# EAGLE design servo_driver (EAGLE 9.3.2)
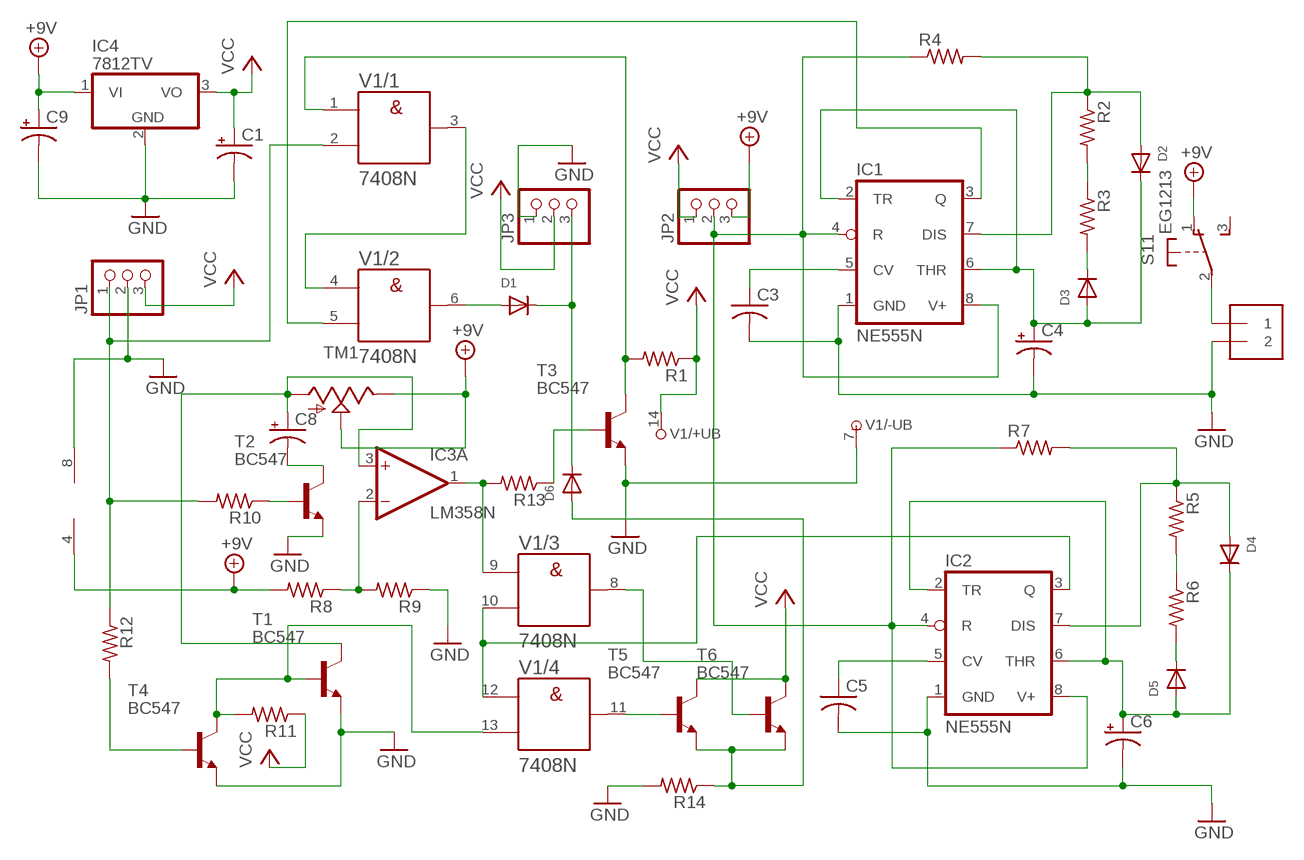
[diagram p0: schematic, sheet 1]

## Parts
C1  CPOL-USE2-4  [E2-4]
C3  C-US025-030X050  [C025-030X050]
C4  CPOL-USE2-4  [E2-4]
C5  C-US025-030X050  [C025-030X050]
C6  CPOL-USE2-4  [E2-4]
C8  CPOL-USE2.5-6  [E2,5-6]
C9  CPOL-USE2.5-6  [E2,5-6]
D1  DIODEDO-1N4148  [DO-1N4148]
D2  DIODEDO-1N4148  [DO-1N4148]
D3  DIODEDO-1N4148  [DO-1N4148]
D4  DIODEDO-1N4148  [DO-1N4148]
D5  DIODEDO-1N4148  [DO-1N4148]
D6  DIODEDO-1N4148  [DO-1N4148]
IC1  NE555N  [DIL08-ROUND]
IC2  NE555N  [DIL08-ROUND]
IC3  LM358N  [DIL08]
IC4  7812TV  [TO220V]
J1  1X2-3.5MM  [1X2-3.5MM]
JP1  PINHD-1X3  [1X03]
JP2  PINHD-1X3  [1X03]
JP3  PINHD-1X3  [1X03]
R1  R-US_0207/9  [0207/9]
R2  R-US_0207/9  [0207/9]
R3  R-US_0207/9  [0207/9]
R4  R-US_0207/9  [0207/9]
R5  R-US_0207/9  [0207/9]
R6  R-US_0207/9  [0207/9]
R7  R-US_0207/9  [0207/9]
R8  R-US_0207/9  [0207/9]
R9  R-US_0207/9  [0207/9]
R10  R-US_0207/9  [0207/9]
R11  R-US_0207/9  [0207/9]
R12  R-US_0207/9  [0207/9]
R13  R-US_0207/9  [0207/9]
R14  R-US_0207/9  [0207/9]
S1  EG1213  [EG1213]
T1  BC547  [TO92]
T2  BC547  [TO92]
T3  BC547  [TO92]
T4  BC547  [TO92]
T5  BC547  [TO92]
T6  BC547  [TO92]
TM1  TRIM  [6MM]
V1  7408N  [DIL14]

## Nets
+9V: C9.+ IC3.4(P:V-) IC4.1(VI) JP2.3 R8.2 S1.1(1:O) TM1.E TM1.S
GND: C1.- C3.2 C4.- C5.2 C6.- C9.- IC1.1(GND) IC2.1(GND) IC3.8(P:V+) IC4.2(GND) J1.2 JP1.2 JP3.1 R9.1 R14.2 T1.1(E) T2.1(E) T3.1(E) T4.1(E) V1.7(/-UB:-UB)
N$1: C4.+ D2.C D3.A IC1.2(TR) IC1.6(THR)
N$2: V1.3(/1:Y) V1.4(/2:A)
N$3: C3.1 IC1.5(CV)
N$4: C6.+ D4.C D5.A IC2.2(TR) IC2.6(THR)
N$5: R2.2 R3.1
N$6: D2.A IC1.7(DIS) R2.1 R4.2
N$7: D3.C R3.2
N$8: C8.- T2.3(C)
N$9: C5.1 IC2.5(CV)
N$10: R5.2 R6.1
N$11: D4.A IC2.7(DIS) R5.1 R7.2
N$12: D5.C R6.2
N$13: D1.A V1.6(/2:Y)
N$14: D1.C D6.C JP3.3
N$15: R1.2 T3.3(C) V1.1(/1:A)
N$16: R13.1 T3.2(B)
N$17: IC3.2(A:-IN) R8.1 R9.2
N$18: D6.A R14.1 T5.1(E) T6.1(E)
N$19: C8.+ IC3.3(A:+IN) T1.3(C) TM1.A
N$20: JP1.1 R10.2 R12.1 V1.2(/1:B)
N$21: R10.1 T2.2(B)
N$22: R11.2 T1.2(B) T4.3(C) V1.13(/4:B)
N$23: R12.2 T4.2(B)
N$24: J1.1 S1.2(1:P)
N$25: IC1.4(R) IC1.8(V+) IC2.4(R) IC2.8(V+) JP2.2 R4.1 R7.1
N$26: IC1.3(Q) V1.5(/2:B)
N$27: IC3.1(A:OUT) R13.2 V1.9(/3:A)
N$28: IC2.3(Q) V1.10(/3:B) V1.12(/4:A)
N$29: T6.2(B) V1.8(/3:Y)
N$30: T5.2(B) V1.11(/4:Y)
VCC: C1.+ IC4.3(VO) JP1.3 JP2.1 JP3.2 R1.1 R11.1 T5.3(C) T6.3(C) V1.14(/+UB:+UB)
Unconnected: IC3.5(B:+IN) IC3.6(B:-IN) IC3.7(B:OUT) S1.3(1:S) S1.MT1(MT) S1.MT2(MT)

## Library data of the parts
C1 C4 C6 C8 C9 = adafruit:CPOL-US: POLARIZED CAPACITOR, American symbol
C3 C5 = adafruit:C-US: CAPACITOR, American symbol
D1-D6 = adafruit:DIODE: Diode SMADIODE - SMA Surface Mount Package 20V 1A Schottky Diode Digikey: 641-1014-6-ND DO-1N4148 - Through Hole Small Current Diode SOD-123 20V 1 A (.5mV Vf) Schottky Diode - Digikey: MBRX120TPMSCT-ND SOD-323 10V 570mA (.38mV Vf, 3ns) Schottky Diode - Digikey: ZLLS410CT-ND SOD-523 30V 30mA Schottky Diode (RB751S-40TE61) - Digikey: RB751S-40TE61CT-ND SOT23-R/W - SOT23 Package (R = Solder Paste/Reflow Ovens, W = Hand-Soldering) BAT54Film 40V 300mA - Digikey: 497-7162-1-ND
IC1 IC2 = adafruit:*555: TIMER Changed DIP package to have round (not oval) pin pads http://www.ladyada.net/library/pcb/eaglelibrary.html
IC3 = linear:LM358: OP AMP also LM158; LM258; LM2904 Source: http://cache.national.com/ds/LM/LM158.pdf
IC4 = linear:78*: Positive VOLTAGE REGULATOR Source: http://cache.national.com/ds/LM/LM78L05.pdf http://www.fairchildsemi.com/ds/LM/LM7805.pdf
J1 = adafruit:1X2: 3.5mm Terminal block http://www.ladyada.net/library/pcb/eaglelibrary.html
JP1-JP3 = adafruit:PINHD-1X3: PIN HEADER
R1-R14 = adafruit:R-US_: RESISTOR, American symbol
S1 = adafruit:EG1213: E-Switch right-angle slide SPDT Part #EG1213 http://www.ladyada.net/library/eagle
T1-T6 = transistor:BC547: NPN TRANSISTOR
TM1 = adafruit:TRIM
V1 = 74ttl-din:74*08: Quad 2-input AND gate

## Board
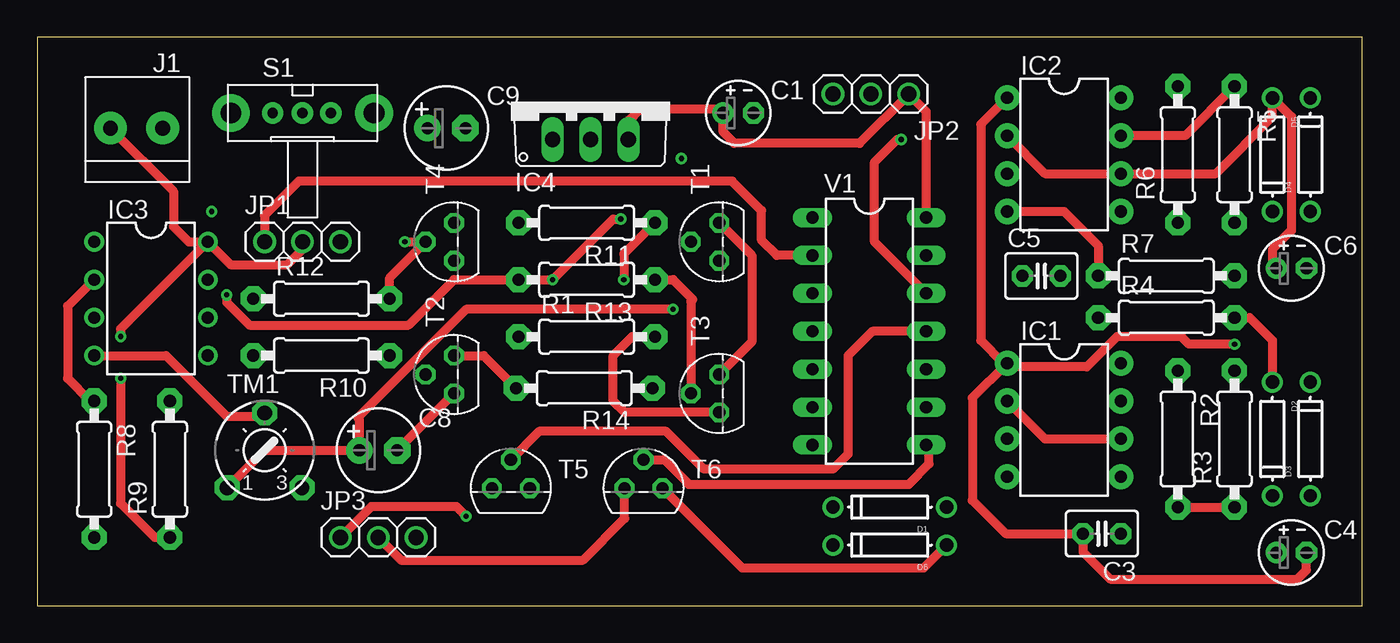
[diagram p1: board, top side]
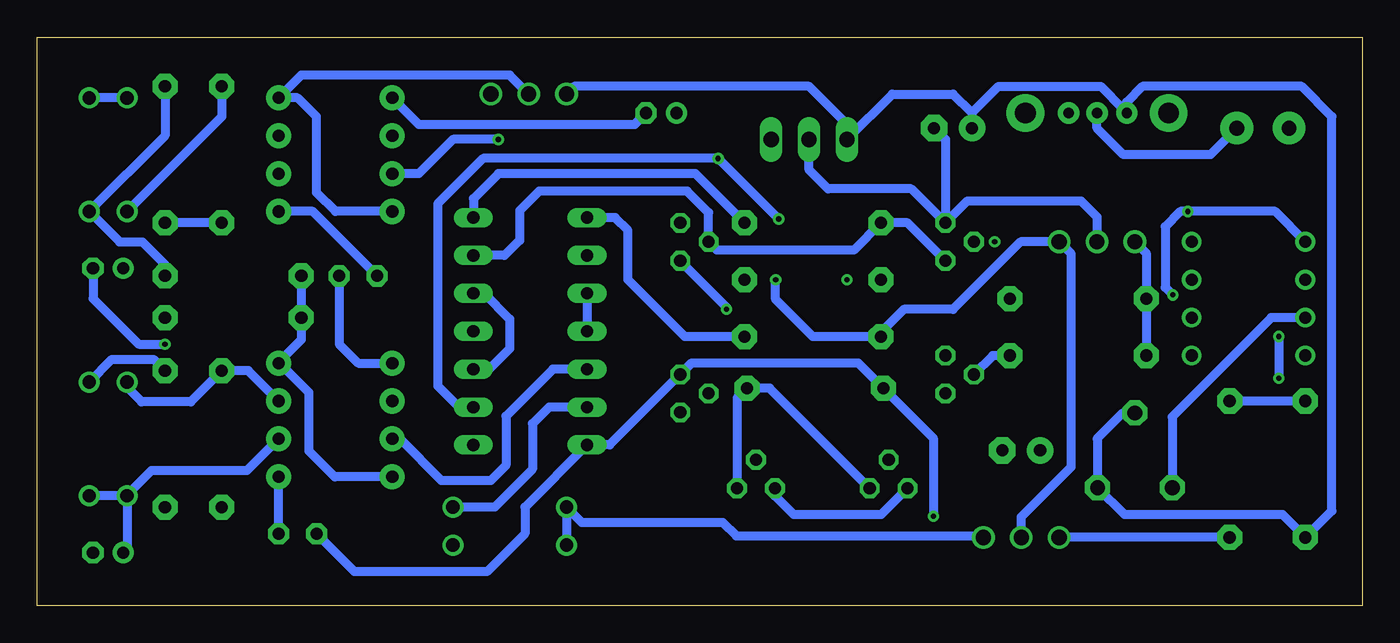
[diagram p2: board, bottom side, seen from below]

Size 88.82 x 38.09 mm. Coordinates in mm from the lower left corner, seen from the top.
Outline: 0,0 88.82,0 88.82,38.09 0,38.09 0,0
Copper layers (1*16): Top 0.035mm / dielectric 1.5mm / Bottom 0.035mm
Design rules "default": minimum track width 6mil, minimum drill 0.35mm, track to track 6mil, track to pad 6mil, pad to pad 6mil, via to via 6mil, smd to smd 6mil, copper to edge 40mil, drill to drill 6mil, minimum pad ring 10mil, minimum via ring 8mil, stop-mask expansion 4mil, vias tented up to drill 0mil, thermal gap 10mil

### Footprints (pad centres in the part's own frame; a part is rotated, then mirrored left to right if it is on the bottom)
E2-4 = drill 0.813 pad 1.422: + -1.016,0 | drill 0.813 pad 1.422 octagon: - 1.016,0
C025-030X050 = drill 0.813 pad 1.422 octagon: 1 -1.27,0; 2 1.27,0
E2,5-6 = drill 0.813 pad 1.778: + -1.27,0 | drill 0.813 pad 1.778 octagon: - 1.27,0
DO-1N4148 = drill 0.9: A -3.81,0; C 3.81,0
DIL08-ROUND = drill 0.813 pad 1.676: 1 -3.81,-3.81; 2 -1.27,-3.81; 3 1.27,-3.81; 4 3.81,-3.81; 5 3.81,3.81; 6 1.27,3.81; 7 -1.27,3.81; 8 -3.81,3.81
DIL08 = drill 0.813 pad 1.27: 1 -3.81,-3.81; 2 -1.27,-3.81; 3 1.27,-3.81; 4 3.81,-3.81; 5 3.81,3.81; 6 1.27,3.81; 7 -1.27,3.81; 8 -3.81,3.81
TO220V = drill 1.016 long: 1 -2.54,-2.54; 2 0,-2.54; 3 2.54,-2.54
1X2-3.5MM = drill 1 pad 2.184: 1 1.8,0; 2 -1.7,0
1X03 = drill 1.016: 1 -2.54,0; 2 0,0; 3 2.54,0
0207/9 = drill 0.813 pad 1.676 octagon: 1 -4.572,0; 2 4.572,0
EG1213 = drill 0.7 pad 1.422: 1 -2,0; 2 0,0; 3 1.9,0 | drill 1.4 pad 2.54: MT1 -4.8,0; MT2 4.8,0
TO92 = drill 0.813 octagon: 1 1.27,0; 2 0,1.905; 3 -1.27,0
6MM = drill 1 pad 1.676 octagon: A -2.5,-2.5; E 2.5,-2.5; S 0,2.5
DIL14 = drill 0.813 long: 1 -7.62,-3.81; 2 -5.08,-3.81; 3 -2.54,-3.81; 4 0,-3.81; 5 2.54,-3.81; 6 5.08,-3.81; 7 7.62,-3.81; 8 7.62,3.81; 9 5.08,3.81; 10 2.54,3.81; 11 0,3.81; 12 -2.54,3.81; 13 -5.08,3.81; 14 -7.62,3.81

### Placement (x,y rotation side)
C1  46.99,33.02 0 top
C3  71.37,4.83 180 top
C4  84.07,3.56 0 top
C5  67.31,22.1 0 top
C6  84.07,22.61 0 top
C8  22.86,10.41 0 top
C9  27.43,32 0 top
D1  57.15,6.6 180 top
D2  82.8,11.18 270 top
D3  85.34,11.18 90 top
D4  85.34,30.23 90 top
D5  82.8,30.23 270 top
D6  57.15,4.06 180 top
IC1  68.83,12.45 270 top
IC2  68.83,30.23 270 top
IC3  7.62,20.57 270 top
IC4  37.08,33.78 0 top
J1  6.6,32 0 top
JP1  17.78,24.38 0 top
JP2  55.88,34.29 180 top
JP3  22.86,4.57 0 top
R1  36.83,18.03 0 top
R2  76.45,11.18 270 top
R3  80.26,11.18 90 top
R4  75.69,19.3 0 top
R5  80.26,30.23 270 top
R6  76.45,30.23 90 top
R7  75.69,22.1 0 top
R8  3.81,9.14 270 top
R9  8.89,9.14 90 top
R10  19.05,16.76 180 top
R11  36.83,25.65 180 top
R12  19.05,20.57 0 top
R13  36.83,21.84 180 top
R14  36.68,14.58 180 top
S1  17.78,33.02 0 top
T1  45.72,24.38 90 top
T2  27.94,15.49 90 top
T3  45.72,14.22 90 top
T4  27.94,24.38 90 top
T5  31.75,7.87 0 top
T6  40.64,7.87 0 top
TM1  15.24,10.41 0 top
V1  55.78,18.39 270 top

### Tracks (layer width: path | path; a pad name or v marks a point on that pad's centre or on a via)
+9V
  Top 0.61: IC3.4 8.64,16.76 12.7,12.7 15.03,12.7 TM1.S
  Bottom 0.61: TM1.S 16.04,12.91 17.78,11.18 17.74,11.14 TM1.E 15.92,6.1 5.33,6.1 R8.2 2.03,6.35 2.03,32.77 4.06,34.8 14.73,34.8 15.78,33.75 15.78,33.27 | JP2.3 52.83,34.8 37.08,34.8 34.54,32.26 IC4.1 31.5,34.29 27.43,34.29 26.16,33.02 | 15.78,33.27 S1.1 | C9.+ 26.16,32.51 26.16,33.02 | 26.16,33.02 24.38,34.8 17.53,34.8 16,33.27 15.78,33.27
GND  (via drill 0.35)
  Top 0.61: IC1.1 62.69,13.92 62.69,7.06 64.92,4.83 C3.2 70.1,3.61 71.93,1.78 84.48,1.78 85.09,2.39 C4.- | T1.1 47.9,23.47 47.9,17.68 T3.1 | JP3.1 22.4,6.66 28.09,6.66 v28.75,5.99 | T2.1 29.92,16.76 R14.2 | IC3.8 12.95,22.86 16.76,22.86 17.78,23.88 JP1.2 | v80.26,17.53 77.22,17.53 76.71,18.03 72.39,18.03 70.36,16 65.28,16 IC1.1 | IC2.1 63.25,32.26 63.25,17.78 64.77,16.26 IC1.1 | IC3.8 5.59,18.54 v5.59,18.03 | v5.59,15.24 5.59,6.86 7.87,4.57 R9.1 | J1.2 9.14,27.76 9.14,25.4 10.16,24.38 IC3.8
  Bottom 0.61: T4.1 26.47,27.13 18.85,27.13 17.78,26.06 JP1.2 | v28.75,5.99 28.75,11.23 R14.2 33.78,16.26 44.96,16.26 T3.1 50.44,10.77 V1.7 56.13,6.6 56.13,4.83 58.67,2.29 67.56,2.29 C3.2 | R9.1 JP3.1 | C5.2 68.58,17.53 67.31,16.26 IC1.1 | C6.- 85.09,20.57 82.04,17.53 v80.26,17.53 | T4.1 30.23,27.94 35.81,27.94 37.08,29.21 IC4.2 | IC2.1 63.25,32.26 48.77,32.26 C1.- | v5.59,18.03 v5.59,15.24 | C9.- 27.94,31.24 T4.1
N$1
  Top 0.61: IC1.2 67.56,11.18 IC1.6
  Bottom 0.61: IC1.6 74.78,9.04 81.18,9.04 82.8,7.42 D2.C | D2.C D3.A | D2.C 82.8,3.81 C4.+
N$2
  Bottom 0.61: V1.3 V1.4
N$3
  Bottom 0.61: C3.1 IC1.5
N$4
  Top 0.61: C6.+ 82.8,22.86 82.8,23.88 84.07,25.15 84.07,32.77 D5.A 82.8,32.77 78.99,28.96 IC2.6 67.56,28.96 IC2.2
  Bottom 0.61: D5.A D4.C
N$5
  Top 0.61: R2.2 R3.1
N$6
  Top 0.61: R4.2 81.28,19.3 82.8,17.78 D2.A
  Bottom 0.61: IC1.7 74.68,15.75 R2.1 78.54,13.66 81.84,13.66 82.8,14.63 D2.A
N$7
  Bottom 0.61: D3.C 83.82,16.51 81.03,16.51 R3.2
N$8
  Top 0.61: T2.3 C8.-
N$9
  Bottom 0.61: C5.1 70.36,26.42 IC2.5
N$10
  Bottom 0.61: R6.1 R5.2
N$11
  Top 0.61: R5.1 76.96,31.5 IC2.7
  Bottom 0.61: R5.1 80.26,31.5 D4.A 83.31,24.38 81.79,24.38 80.26,22.86 R7.2
N$12
  Bottom 0.61: R6.2 76.45,32.77 D5.C
N$13
  Bottom 0.61: V1.6 54.51,13.31 55.63,12.19 55.63,9.14 58.17,6.6 D1.A
N$14
  Bottom 0.61: JP3.3 25.5,4.67 41.96,4.67 42.88,5.59 52.32,5.59 D1.C D6.C
N$15
  Top 0.61: T3.3 39.37,12.95 38.61,13.72 38.61,16.76 39.88,18.03 R1.2
  Bottom 0.61: R1.2 45.42,18.03 49.22,21.84 49.22,25.15 50.09,26.01 V1.1
N$16
  Top 0.61: R13.1 42.62,21.84 43.94,20.52 43.81,20.4 T3.2
N$17
  Top 0.61: IC3.2 2.03,20.07 2.03,15.24 3.56,13.72 R8.1
  Bottom 0.61: R8.1 R9.2
N$18
  Top 0.61: T6.1 47.24,2.54 59.44,2.54 D6.A
  Bottom 0.61: T6.1 41.91,13.92 R14.1 39.73,14.58 T5.1
N$19  (via drill 0.35)
  Top 0.61: v42.62,19.86 28.75,19.86 21.49,12.6 21.59,12.5 C8.+ 15.24,10.41 TM1.A
  Bottom 0.61: T1.3 42.62,20.02 v42.62,19.86 | IC3.3 6.1,19.3 12.74,12.66 TM1.A
N$20
  Top 0.61: V1.2 49.58,23.47 48.56,24.49 48.56,26.47 46.58,28.45 17.53,28.45 15.24,26.16 JP1.1
  Bottom 0.61: JP1.1 14.48,23.62 R12.1 R10.2
N$21
  Bottom 0.61: R10.1 24.77,16.76 T2.2
N$22
  Bottom 0.61: T4.3 30.48,25.65 R11.2 34.09,23.82 43.26,23.82 T1.2 43.81,26.34 45.26,27.79 55.17,27.79 56.49,26.47 56.49,24.49 57.51,23.47 V1.13
N$23  (via drill 0.35)
  Top 0.61: R12.2 23.62,21.97 T4.2 v24.64,24.38
N$24
  Bottom 0.61: J1.1 10.18,30.23 16,30.23 17.78,32 S1.2
N$25
  Top 0.61: IC2.4 68.83,26.42 71.12,24.13 R7.1
  Bottom 0.61: IC2.4 68.83,26.42 70.1,27.69 70.1,32.77 71.37,34.04 IC2.8 71.12,35.56 57.15,35.56 JP2.2 | 72.64,16.31 IC1.8 | IC1.4 68.89,8.64 70.61,10.36 70.61,14.27 72.64,16.31 | R7.1 R4.1 71.12,17.83 72.64,16.31
N$26
  Bottom 0.61: V1.5 54.25,15.85 57.4,12.7 57.4,9.4 58.42,8.38 61.72,8.38 64.52,11.18 IC1.3
N$27  (via drill 0.35)
  Top 0.61: v39.12,25.91 38.61,25.91 v34.54,21.84 R13.2 27.94,21.84 24.89,18.8 14.22,18.8 12.7,20.32 v12.7,20.83
  Bottom 0.61: v39.12,25.91 v43.18,29.97 58.93,29.97 61.98,26.92 61.98,14.73 60.45,13.21 60.35,13.31 V1.9 | IC3.1 5.84,26.42 v11.68,26.42 12.19,26.42 13.21,25.4 13.21,21.34 v12.7,20.83
N$28  (via drill 0.35)
  Top 0.61: V1.12 56.13,24.38 56.13,29.72 57.66,31.24 v57.91,31.24
  Bottom 0.61: V1.12 58.88,20.93 57.15,19.2 57.15,17.22 58.52,15.85 V1.10 | v57.91,31.24 60.96,31.24 63.25,28.96 IC2.3
N$29
  Top 0.61: V1.8 59.79,10.57 59.79,9.5 58.42,8.13 43.69,8.13 42.04,9.78 T6.2
N$30
  Top 0.61: V1.11 55.98,18.39 54.36,16.76 54.36,10.16 53.34,9.14 44.7,9.14 42.16,11.68 33.66,11.68 T5.2
VCC  (via drill 0.35)
  Top 0.61: R11.1 39.32,23.57 v39.32,21.84 | JP3.2 24.38,3.05 36.58,3.05 39.37,5.84 T6.3 | V1.14 59.59,33.12 JP2.1 55.12,30.99 46.74,30.99 45.97,31.75 C1.+ 45.72,33.27 40.39,33.27 39.62,32.51 IC4.3
  Bottom 0.61: v39.32,21.84 39.32,20.52 36.83,18.03 R1.1 32.26,18.34 30.73,19.86 27.43,19.86 22.91,24.38 JP1.3 19.51,23.57 19.51,9.3 22.86,5.94 JP3.2 | T5.3 32.26,6.1 38.1,6.1 39.37,7.37 T6.3 | R11.1 44.7,28.96 57.91,28.96 59.59,27.28 V1.14